# EAGLE schematic alphanewt_v0.5 (EAGLE 8.2.2)
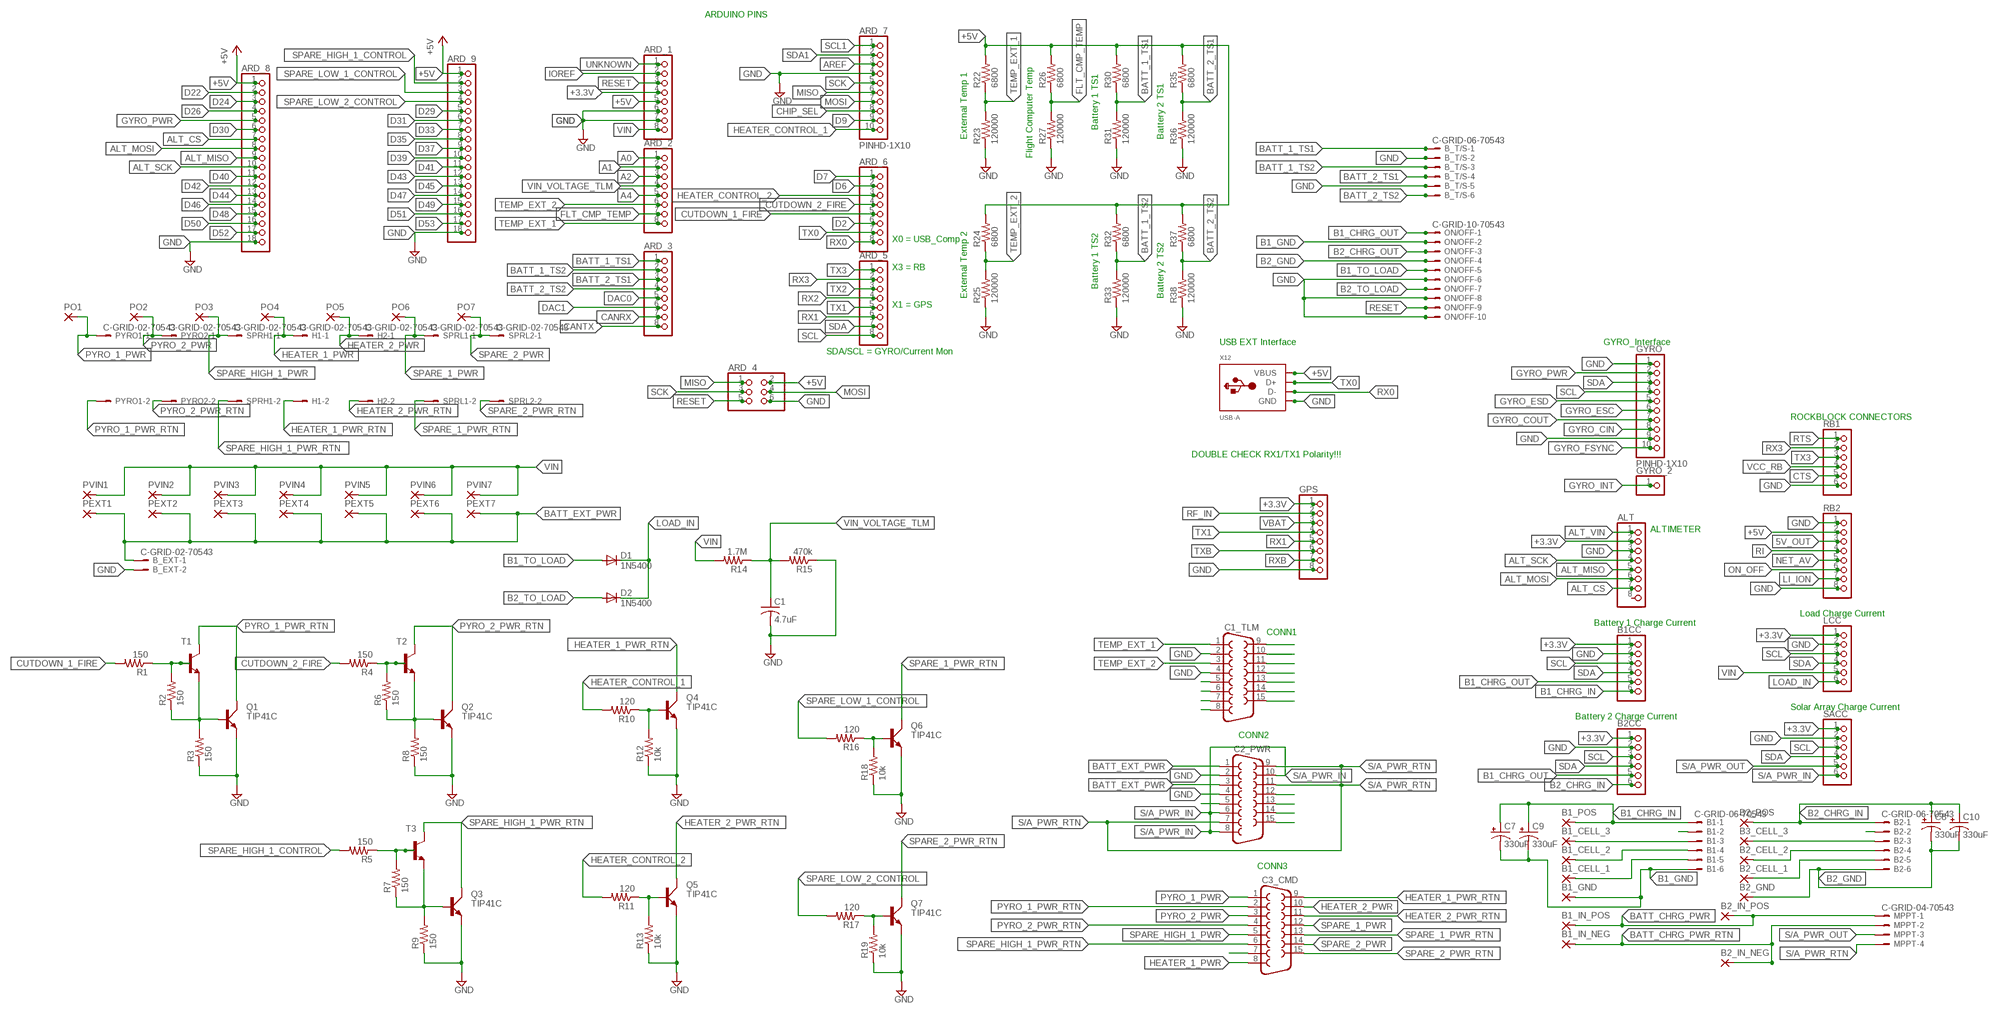
[diagram p0: schematic, sheet 1]

## Parts
ALT  PINHD-1X8BIG  [1X08-BIG]
ARD_1  PINHD-1X8BIG  [1X08-BIG]
ARD_2  PINHD-1X8BIG  [1X08-BIG]
ARD_3  PINHD-1X8BIG  [1X08-BIG]
ARD_4  PINHD-2X3  [2X03]
ARD_5  PINHD-1X8BIG  [1X08-BIG]
ARD_6  PINHD-1X8BIG  [1X08-BIG]
ARD_7  PINHD-1X10  [1X10-BIG]
ARD_8  PINHD-1X18-BIG  [1X18-BIG]
ARD_9  PINHD-1X18-BIG  [1X18-BIG]
B1  C-GRID-06-70543  [70543-06]
B1_CELL_1  SMD5  [SMD2,54-5,08]
B1_CELL_2  SMD5  [SMD2,54-5,08]
B1_CELL_3  SMD5  [SMD2,54-5,08]
B1_GND  SMD5  [SMD2,54-5,08]
B1_IN_NEG  SMD5  [SMD2,54-5,08]
B1_IN_POS  SMD5  [SMD2,54-5,08]
B1_POS  SMD5  [SMD2,54-5,08]
B1CC  PINHD-1X6B  [1X06-BIG]
B2  C-GRID-06-70543  [70543-06]
B2_CELL_1  SMD5  [SMD2,54-5,08]
B2_CELL_2  SMD5  [SMD2,54-5,08]
B2_GND  SMD5  [SMD2,54-5,08]
B2_IN_NEG  SMD5  [SMD2,54-5,08]
B2_IN_POS  SMD5  [SMD2,54-5,08]
B2_POS  SMD5  [SMD2,54-5,08]
B2CC  PINHD-1X6B  [1X06-BIG]
B3_CELL_3  SMD5  [SMD2,54-5,08]
B_EXT  C-GRID-02-70543  [70543-02]
B_T/S  C-GRID-06-70543  [70543-06]
C1  4.7uF  C-USC0805K  [C0805K]
C1_TLM  F15HP  [F15HP]
C2_PWR  F15HP  [F15HP]
C3_CMD  F15HP  [F15HP]
C7  330uF  CPOL-USCT7343  [CT7343]
C8  330uF  CPOL-USCT7343  [CT7343]
C9  330uF  CPOL-USCT7343  [CT7343]
C10  330uF  CPOL-USCT7343  [CT7343]
D1  1N5400  [DO201-15]
D2  1N5400  [DO201-15]
GPS  PINHD-1X8BIG  [1X08-BIG]
GYRO  PINHD-1X10  [1X10-BIG]
GYRO_2  PINHD-1X1  [1X01]
H1  C-GRID-02-70543  [70543-02]
H2  C-GRID-02-70543  [70543-02]
LCC  PINHD-1X6B  [1X06-BIG]
MPPT  C-GRID-04-70543  [70543-04]
ON/OFF  C-GRID-10-70543  [70543-10]
PEXT1  SMD2  [SMD1,27-2,54]
PEXT2  SMD2  [SMD1,27-2,54]
PEXT3  SMD2  [SMD1,27-2,54]
PEXT4  SMD2  [SMD1,27-2,54]
PEXT5  SMD2  [SMD1,27-2,54]
PEXT6  SMD2  [SMD1,27-2,54]
PEXT7  SMD2  [SMD1,27-2,54]
PO1  SMD2  [SMD1,27-2,54]
PO2  SMD2  [SMD1,27-2,54]
PO3  SMD2  [SMD1,27-2,54]
PO4  SMD2  [SMD1,27-2,54]
PO5  SMD2  [SMD1,27-2,54]
PO6  SMD2  [SMD1,27-2,54]
PO7  SMD2  [SMD1,27-2,54]
PVIN1  SMD2  [SMD1,27-2,54]
PVIN2  SMD2  [SMD1,27-2,54]
PVIN3  SMD2  [SMD1,27-2,54]
PVIN4  SMD2  [SMD1,27-2,54]
PVIN5  SMD2  [SMD1,27-2,54]
PVIN6  SMD2  [SMD1,27-2,54]
PVIN7  SMD2  [SMD1,27-2,54]
PYRO1  C-GRID-02-70543  [70543-02]
PYRO2  C-GRID-02-70543  [70543-02]
Q1  TIP41C  [TO220AV]
Q2  TIP41C  [TO220AV]
Q3  TIP41C  [TO220AV]
Q4  TIP41C  [TO220AV]
Q5  TIP41C  [TO220AV]
Q6  TIP41C  [TO220AV]
Q7  TIP41C  [TO220AV]
R1  150  R-US_R0805  [R0805]
R2  150  R-US_R0805  [R0805]
R3  150  R-US_R0805  [R0805]
R4  150  R-US_R0805  [R0805]
R5  150  R-US_R0805  [R0805]
R6  150  R-US_R0805  [R0805]
R7  150  R-US_R0805  [R0805]
R8  150  R-US_R0805  [R0805]
R9  150  R-US_R0805  [R0805]
R10  120  R-US_R0805  [R0805]
R11  120  R-US_R0805  [R0805]
R12  10k  R-US_R0805  [R0805]
R13  10k  R-US_R0805  [R0805]
R14  1.7M  R-US_R0805  [R0805]
R15  470k  R-US_R0805  [R0805]
R16  120  R-US_R0805  [R0805]
R17  120  R-US_R0805  [R0805]
R18  10k  R-US_R0805  [R0805]
R19  10k  R-US_R0805  [R0805]
R22  6800  R-US_R0805  [R0805]
R23  120000  R-US_R0805  [R0805]
R24  6800  R-US_R0805  [R0805]
R25  120000  R-US_R0805  [R0805]
R26  6800  R-US_R0805  [R0805]
R27  120000  R-US_R0805  [R0805]
R30  6800  R-US_R0805  [R0805]
R31  120000  R-US_R0805  [R0805]
R32  6800  R-US_R0805  [R0805]
R33  120000  R-US_R0805  [R0805]
R35  6800  R-US_R0805  [R0805]
R36  120000  R-US_R0805  [R0805]
R37  6800  R-US_R0805  [R0805]
R38  120000  R-US_R0805  [R0805]
RB1  PINHD-1X6CB  [1X06-CLEANBIG]
RB2  PINHD-1X8BIG  [1X08-BIG]
SACC  PINHD-1X6B  [1X06-BIG]
SPRH1  C-GRID-02-70543  [70543-02]
SPRL1  C-GRID-02-70543  [70543-02]
SPRL2  C-GRID-02-70543  [70543-02]
T1  2N3904  [TO92]
T2  2N3904  [TO92]
T3  2N3904  [TO92]
X12  USB-A  [MOLEX_480371000]

## Nets
5V_OUT: RB2.3
+3.3V: ALT.2 ARD_1.4 B1CC.1 B2CC.1 GPS.1 LCC.1 SACC.1
+5V: ARD_1.5 ARD_4.2 ARD_8.1 ARD_9.1 R22.2 R24.2 R26.2 R30.2 R32.2 R35.2 R37.2 RB2.2 X12.1(VBUS)
A0: ARD_2.1
A1: ARD_2.2
A2: ARD_2.3
A4: ARD_2.5
ALT_CS: ALT.7 ARD_8.7
ALT_MISO: ALT.5 ARD_8.9
ALT_MOSI: ALT.6 ARD_8.8
ALT_SCK: ALT.4 ARD_8.10
ALT_VIN: ALT.1
AREF: ARD_7.3
B1_CHRG_IN: B1.1 B1_POS.1(P) B1CC.6 C7.+ C9.+
B1_CHRG_OUT: B1CC.5 B2CC.5 ON/OFF.1
B1_GND: B1.6 B1_GND.1(P) C7.- C9.- ON/OFF.2
B1_TO_LOAD: D1.A ON/OFF.5
B2_CHRG_IN: B2.1 B2_POS.1(P) B2CC.6 C8.+ C10.+
B2_CHRG_OUT: ON/OFF.3
B2_GND: B2.6 B2_GND.1(P) C8.- C10.- ON/OFF.4
B2_TO_LOAD: D2.A ON/OFF.7
BATT_1_TS1: ARD_3.1 B_T/S.1 R30.1 R31.2
BATT_1_TS2: ARD_3.2 B_T/S.3 R32.1 R33.2
BATT_2_TS1: ARD_3.3 B_T/S.4 R35.1 R36.2
BATT_2_TS2: ARD_3.4 B_T/S.6 R37.1 R38.2
BATT_CHRG_PWR: B1_IN_POS.1(P) B2_IN_POS.1(P) MPPT.1
BATT_CHRG_PWR_RTN: B1_IN_NEG.1(P) B2_IN_NEG.1(P) MPPT.2
BATT_EXT_PWR: B_EXT.1 C2_PWR.1 C2_PWR.3 PEXT1.1(P) PEXT2.1(P) PEXT3.1(P) PEXT4.1(P) PEXT5.1(P) PEXT6.1(P) PEXT7.1(P)
CANRX: ARD_3.7
CANTX: ARD_3.8
CHIP_SEL: ARD_7.8
CTS: RB1.5
CUTDOWN_1_FIRE: ARD_6.5 R1.2
CUTDOWN_2_FIRE: ARD_6.4 R4.2
D2: ARD_6.6
D6: ARD_6.2
D7: ARD_6.1
D9: ARD_7.9
D22: ARD_8.2
D24: ARD_8.3
D26: ARD_8.4
D29: ARD_9.5
D30: ARD_8.6
D31: ARD_9.6
D33: ARD_9.7
D35: ARD_9.8
D37: ARD_9.9
D39: ARD_9.10
D40: ARD_8.11
D41: ARD_9.11
D42: ARD_8.12
D43: ARD_9.12
D44: ARD_8.13
D45: ARD_9.13
D46: ARD_8.14
D47: ARD_9.14
D48: ARD_8.15
D49: ARD_9.15
D50: ARD_8.16
D51: ARD_9.16
D52: ARD_8.17
D53: ARD_9.17
DAC0: ARD_3.5
DAC1: ARD_3.6
FLT_CMP_TEMP: ARD_2.7 R26.1 R27.2
GND: ALT.3 ARD_1.6 ARD_1.7 ARD_4.6 ARD_7.4 ARD_8.18 ARD_9.18 B1CC.2 B2CC.2 B_EXT.2 B_T/S.2 B_T/S.5 C1.2 C1_TLM.2 C1_TLM.4 C2_PWR.2 C2_PWR.4 GPS.8 GYRO.1 GYRO.9 LCC.2 ON/OFF.6 ON/OFF.8 ON/OFF.10 Q1.E Q2.E Q3.E Q4.E Q5.E Q6.E Q7.E R3.1 R8.1 R9.1 R12.1 R13.1 R15.1 R18.1 R19.1 R23.1 R25.1 R27.1 R31.1 R33.1 R36.1 R38.1 RB1.6 RB2.1 RB2.8 SACC.2 X12.4(GND)
GYRO_CIN: GYRO.8
GYRO_COUT: GYRO.7
GYRO_ESC: GYRO.6
GYRO_ESD: GYRO.5
GYRO_FSYNC: GYRO.10
GYRO_INT: GYRO_2.1
GYRO_PWR: ARD_8.5 GYRO.2
HEATER_1_PWR: C3_CMD.8 H1.1 PO4.1(P)
HEATER_1_PWR_RTN: C3_CMD.9 H1.2 Q4.C
HEATER_2_PWR: C3_CMD.10 H2.1 PO5.1(P)
HEATER_2_PWR_RTN: C3_CMD.11 H2.2 Q5.C
HEATER_CONTROL_1: ARD_7.10 R10.2
HEATER_CONTROL_2: ARD_6.3 R11.2
IOREF: ARD_1.2
LI_ION: RB2.7
LOAD_IN: D1.C D2.C LCC.6
MISO: ARD_4.1 ARD_7.6
MOSI: ARD_4.4 ARD_7.7
N$1: B1.2
N$2: B2.2
N$12: C1_TLM.9
N$13: C1_TLM.10
N$15: R4.1 R6.2 T2.2(B)
N$16: R1.1 R2.2 T1.2(B)
N$18: Q4.B R10.1 R12.2
N$19: Q2.B R6.1 R8.2 T2.3(E)
N$20: C1_TLM.11
N$21: C1_TLM.12
N$22: Q5.B R11.1 R13.2
N$23: Q1.B R2.1 R3.2 T1.3(E)
N$24: Q6.B R16.1 R18.2
N$25: C1_TLM.13
N$26: R5.1 R7.2 T3.2(B)
N$27: Q3.B R7.1 R9.2 T3.3(E)
N$28: C1_TLM.14
N$29: B1.5 B1_CELL_1.1(P)
N$30: C1_TLM.15
N$31: Q7.B R17.1 R19.2
N$33: B1.4 B1_CELL_2.1(P)
N$34: B2.3 B3_CELL_3.1(P)
N$35: B2.4 B2_CELL_2.1(P)
N$36: B2.5 B2_CELL_1.1(P)
N$37: B1.3 B1_CELL_3.1(P)
N$40: C1_TLM.5
N$41: C1_TLM.6
N$42: C1_TLM.7
N$43: C1_TLM.8
N$47: C2_PWR.12
N$48: C2_PWR.13
N$49: C2_PWR.14
N$50: C2_PWR.15
N$55: C2_PWR.5
N$72: C3_CMD.7
NET_AV: RB2.5
ON_OFF: RB2.6
PYRO_1_PWR: C3_CMD.1 PO1.1(P) PYRO1.1
PYRO_1_PWR_RTN: C3_CMD.2 PYRO1.2 Q1.C T1.1(C)
PYRO_2_PWR: C3_CMD.3 PO2.1(P) PYRO2.1
PYRO_2_PWR_RTN: C3_CMD.4 PYRO2.2 Q2.C T2.1(C)
RESET: ARD_1.3 ARD_4.5 ON/OFF.9
RF_IN: GPS.2
RI: RB2.4
RTS: RB1.1
RX0: ARD_6.8 X12.2(D-)
RX1: ARD_5.6 GPS.5
RX2: ARD_5.4
RX3: ARD_5.2 RB1.2
RXB: GPS.7
S/A_PWR_IN: C2_PWR.6 C2_PWR.8 C2_PWR.10 SACC.6
S/A_PWR_OUT: MPPT.3 SACC.5
S/A_PWR_RTN: C2_PWR.7 C2_PWR.9 C2_PWR.11 MPPT.4
SCK: ARD_4.3 ARD_7.5
SCL: ARD_5.8 B1CC.3 B2CC.3 GYRO.4 LCC.3 SACC.3
SCL1: ARD_7.1
SDA: ARD_5.7 B1CC.4 B2CC.4 GYRO.3 LCC.4 SACC.4
SDA1: ARD_7.2
SPARE_1_PWR: C3_CMD.12 PO6.1(P) SPRL1.1
SPARE_1_PWR_RTN: C3_CMD.13 Q6.C SPRL1.2
SPARE_2_PWR: C3_CMD.14 PO7.1(P) SPRL2.1
SPARE_2_PWR_RTN: C3_CMD.15 Q7.C SPRL2.2
SPARE_HIGH_1_CONTROL: ARD_9.2 R5.2
SPARE_HIGH_1_PWR: C3_CMD.5 PO3.1(P) SPRH1.1
SPARE_HIGH_1_PWR_RTN: C3_CMD.6 Q3.C SPRH1.2 T3.1(C)
SPARE_LOW_1_CONTROL: ARD_9.3 R16.2
SPARE_LOW_2_CONTROL: ARD_9.4 R17.2
TEMP_EXT_1: ARD_2.8 C1_TLM.1 R22.1 R23.2
TEMP_EXT_2: ARD_2.6 C1_TLM.3 R24.1 R25.2
TX0: ARD_6.7 X12.3(D+)
TX1: ARD_5.5 GPS.4
TX2: ARD_5.3
TX3: ARD_5.1 RB1.3
TXB: GPS.6
UNKNOWN: ARD_1.1
VBAT: GPS.3
VCC_RB: RB1.4
VIN: ARD_1.8 LCC.5 PVIN1.1(P) PVIN2.1(P) PVIN3.1(P) PVIN4.1(P) PVIN5.1(P) PVIN6.1(P) PVIN7.1(P) R14.2
VIN_VOLTAGE_TLM: ARD_2.4 C1.1 R14.1 R15.2
Unconnected: ALT.8

## Notes on the sheet
- ARDUINO PINS
- Battery 1 TS1
- External Temp 1 | Battery 2 TS1
- Flight Computer Temp
- X0 = USB_Comp
- X3 = RB
- Battery 1 TS2
- External Temp 2 | Battery 2 TS2
- X1 = GPS
- USB EXT Interface | GYRO_Interface
- SDA/SCL = GYRO/Current Mon
- ROCKBLOCK CONNECTORS
- DOUBLE CHECK RX1/TX1 Polarity!!!
- ALTIMETER
- Load Charge Current
- Battery 1 Charge Current
- CONN1
- Solar Array Charge Current
- Battery 2 Charge Current
- CONN2
- CONN3

## Library data of the parts
ALT ARD_1-ARD_3 ARD_5 ARD_6 GPS RB2 = adafruit:PINHD-1X8: PIN HEADER; OC_NEWARK: unknown
ARD_4 = pinhead:PINHD-2X3: PIN HEADER; OC_NEWARK: unknown
ARD_7 GYRO = adafruit:PINHD-1X10: Pin header 1x10 0.1" spacing With round pins; OC_NEWARK: unknown
ARD_8 ARD_9 = adafruit:PINHD-1X18: PIN HEADER; OC_NEWARK: unknown
B1 B2 B_T/S = con-molex:C-GRID-06: CONNECTOR wire to board 2.54 mm (0.100") pitch header; MF: MOLEX; MPN: 70543-0005; OC_FARNELL: unknown; OC_NEWARK: 59H2647
B1_CELL_1-B1_CELL_3 B1_GND B1_IN_NEG B1_IN_POS B1_POS B2_CELL_1 B2_CELL_2 B2_GND B2_IN_NEG B2_IN_POS B2_POS B3_CELL_3 = wirepad:SMD5: SMD PAD; OC_NEWARK: unknown
B1CC B2CC LCC RB1 SACC = adafruit:PINHD-1X6: PIN HEADER; OC_NEWARK: unknown
B_EXT H1 H2 PYRO1 PYRO2 SPRH1 SPRL1 SPRL2 = con-molex:C-GRID-02: CONNECTOR wire to board 2.54 mm (0.100") pitch header; MF: MOLEX; MPN: 70543-0001; OC_FARNELL: unknown; OC_NEWARK: 59H2645
C1 = adafruit:C-US: CAPACITOR, American symbol; MPN: C2012X6S1H475K125AC; OC_NEWARK: 95Y0059
C1_TLM C2_PWR C3_CMD = adafruit:F15: SUB-D HDH is also known as a 'right angle VGA' connector; MPN: 5504F1-15S-02A-03; OC_NEWARK: 18T0705
C7-C10 = adafruit:CPOL-US: POLARIZED CAPACITOR, American symbol; MPN: TCN4337M020R0100; OC_NEWARK: 13AC9461
D1 D2 = diode:1N5400: DIODE standard rectifier, 3 A, 50 V (Motorola); MPN: 1N5400-E3/54; OC_NEWARK: 05R5997
GYRO_2 = adafruit:PINHD-1X1: Pin header 1x1 for 0.1" spacing With round pins; OC_NEWARK: unknown
MPPT = con-molex:C-GRID-04: CONNECTOR wire to board 2.54 mm (0.100") pitch header; MF: MOLEX; MPN: 70543-0038; OC_FARNELL: unknown; OC_NEWARK: 59H2665
ON/OFF = con-molex:C-GRID-10: CONNECTOR wire to board 2.54 mm (0.100") pitch header; MF: MOLEX; MPN: 70543-0009; OC_FARNELL: unknown; OC_NEWARK: 59H2651
PEXT1-PEXT7 PO1-PO7 PVIN1-PVIN7 = wirepad:SMD2: SMD PAD; OC_NEWARK: unknown
Q1-Q7 = transistor-power:TIP41C: NPN TRANSISTOR; MF: FAIRCHILD SEMICONDUCTOR; MPN: TIP41C; OC_NEWARK: 58K2429
R1-R19 R22-R27 R30-R33 R35-R38 = adafruit:R-US_: RESISTOR, American symbol; MF: VISHAY/DALE; MPN: CRCW120633R2FKEA; OC_NEWARK: 42K4999
T1-T3 = transistor:2N3904: NPN TRANSISTOR; MF: NTE ELECTRONICS; MPN: 2N3904; OC_NEWARK: 33C8259
X12 = adafruit:USB-A: USB type A 'plug' Used for things that can directly connect to a USB port, say USB key; MPN: UE27-AC54-10H; OC_NEWARK: 01M3183

## Net classes
0 default: width 0.305 mm, drill 0.508 mm, clearance 0.254 mm
1 PWR: width 0.406 mm, drill 0.508 mm, clearance 0.305 mm